# EAGLE schematic spicboard-v3 (EAGLE 8.1.1)
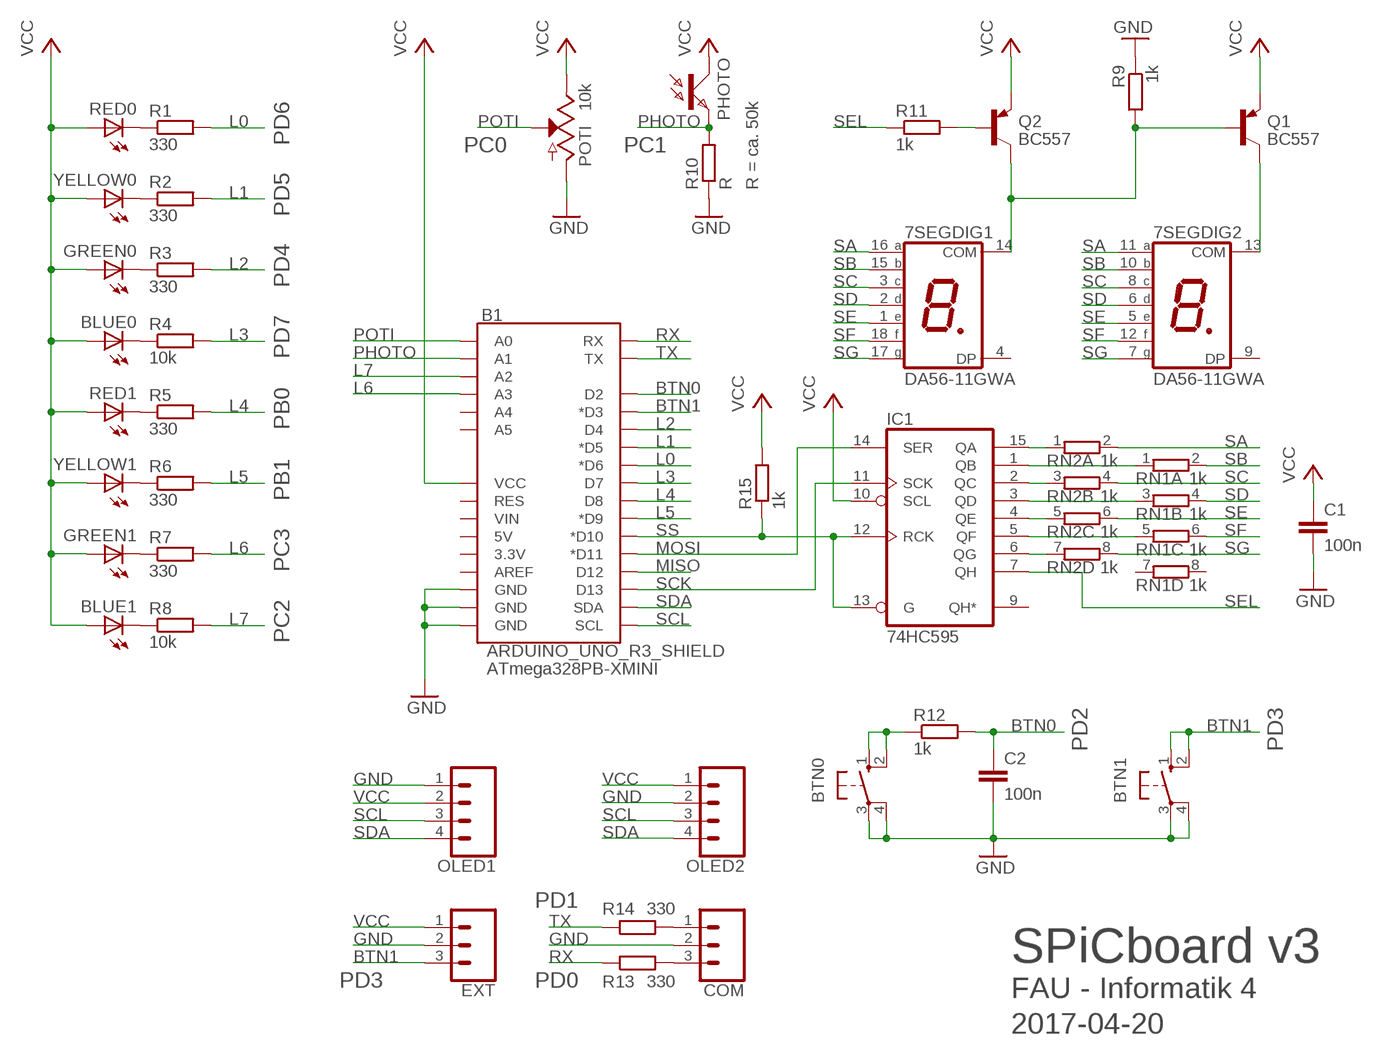
[diagram p0: schematic, sheet 1]

## Parts
7SEG  DA56-11GWA  [DA56]
B1  ARDUINO_UNO_R3_SHIELD  [UNO_R3_SHIELD_FINAL]
BLUE0  LED5MM  [LED5MM]
BLUE1  LED5MM  [LED5MM]
BTN0  10-XX  [B3F-10XX]
BTN1  10-XX  [B3F-10XX]
C1  100n  C2.5/2  [C2.5-2]
C2  100n  C2.5/2  [C2.5-2]
COM  CONN_03  [1X03]
EXT  CONN_03  [1X03]
GREEN0  LED5MM  [LED5MM]
GREEN1  LED5MM  [LED5MM]
IC1  74HC595  74HC595N  [DIL16]
OLED1  CONN_04  [1X04]
OLED2  CONN_04  [1X04]
PHOTO  PTPT  [PT]
POTI  10k  POTENTIOMETER-PTH-9MM-1/20W-20%  [POT-PTH-ALPS]
Q1  BC557  [TO92-EBC]
Q2  BC557  [TO92-EBC]
R1  330  R-EU_0207/10  [0207/10]
R2  330  R-EU_0207/10  [0207/10]
R3  330  R-EU_0207/10  [0207/10]
R4  10k  R-EU_0207/10  [0207/10]
R5  330  R-EU_0207/10  [0207/10]
R6  330  R-EU_0207/10  [0207/10]
R7  330  R-EU_0207/10  [0207/10]
R8  10k  R-EU_0207/10  [0207/10]
R9  1k  R-EU_0207/10  [0207/10]
R10  R  R-EU_0207/10  [0207/10]
R11  1k  R-EU_0207/10  [0207/10]
R12  1k  R-EU_0207/10  [0207/10]
R13  330  R-EU_0207/10  [0207/10]
R14  330  R-EU_0207/10  [0207/10]
R15  1k  R-EU_0207/10  [0207/10]
RED0  LED5MM  [LED5MM]
RED1  LED5MM  [LED5MM]
RN1  1k  E4R  [SIL8]
RN2  1k  E4R  [SIL8]
YELLOW0  LED5MM  [LED5MM]
YELLOW1  LED5MM  [LED5MM]

## Nets
BTN0: B1.D2 C2.1 R12.2
BTN1: B1.D3(*D3) BTN1.1(S) BTN1.2(S1) EXT.3
GND: B1.GND@0(GND) B1.GND@1(GND) B1.GND@2(GND) BTN0.3(P) BTN0.4(P1) BTN1.3(P) BTN1.4(P1) C1.2 C2.2 COM.2 EXT.2 OLED1.1 OLED2.2 POTI.P$3(A) R9.1 R10.1
L0: B1.D6(*D6) R1.2
L1: B1.D5(*D5) R2.2
L2: B1.D4 R3.2
L3: B1.D7 R4.2
L4: B1.D8 R5.2
L5: B1.D9(*D9) R6.2
L6: B1.A3 R7.2
L7: B1.A2 R8.2
MISO: B1.D12
MOSI: B1.D11(*D11) IC1.14(SER)
N$1: IC1.15(QA) RN2.1
N$2: R1.1 RED0.K(C)
N$3: R2.1 YELLOW0.K(C)
N$4: GREEN0.K(C) R3.1
N$5: BLUE0.K(C) R4.1
N$6: R5.1 RED1.K(C)
N$7: R6.1 YELLOW1.K(C)
N$8: GREEN1.K(C) R7.1
N$9: BLUE1.K(C) R8.1
N$10: IC1.2(QC) RN2.3
N$11: IC1.4(QE) RN2.5
N$12: IC1.6(QG) RN2.7
N$13: IC1.3(QD) RN1.3
N$14: IC1.1(QB) RN1.1
N$15: COM.1 R14.2
N$16: IC1.5(QF) RN1.5
N$17: 7SEG.13(DIG2:COM) Q1.C
N$18: 7SEG.14(DIG1:COM) Q1.B Q2.C R9.2
N$19: BTN0.1(S) BTN0.2(S1) R12.1
N$20: Q2.B R11.2
N$21: COM.3 R13.2
PHOTO: B1.A1 PHOTO.E R10.2
POTI: B1.A0 POTI.P$2(S)
RX: B1.RX R13.1
SA: 7SEG.11(DIG2:A) 7SEG.16(DIG1:A) RN2.2
SB: 7SEG.10(DIG2:B) 7SEG.15(DIG1:B) RN1.2
SC: 7SEG.3(DIG1:C) 7SEG.8(DIG2:C) RN2.4
SCK: B1.D13 IC1.11(SCK)
SCL: B1.SCL OLED1.3 OLED2.3
SD: 7SEG.2(DIG1:D) 7SEG.6(DIG2:D) RN1.4
SDA: B1.SDA OLED1.4 OLED2.4
SE: 7SEG.1(DIG1:E) 7SEG.5(DIG2:E) RN2.6
SEL: IC1.7(QH) R11.1
SF: 7SEG.12(DIG2:F) 7SEG.18(DIG1:F) RN1.6
SG: 7SEG.7(DIG2:G) 7SEG.17(DIG1:G) RN2.8
SS: B1.D10(*D10) IC1.12(RCK) IC1.13(G) R15.1
TX: B1.TX R14.1
VCC: B1.VCC BLUE0.A BLUE1.A C1.1 EXT.1 GREEN0.A GREEN1.A IC1.10(SCL) OLED1.2 OLED2.1 PHOTO.C POTI.P$1(E) Q1.E Q2.E R15.2 RED0.A RED1.A YELLOW0.A YELLOW1.A
Unconnected: 7SEG.4(DIG1:DP) 7SEG.9(DIG2:DP) B1.3.3V B1.5V B1.A4 B1.A5 B1.AREF B1.RES B1.VIN IC1.9(QH*) RN1.7 RN1.8

## Notes on the sheet
- PD6
- PC0 | PC1
- R = ca. 50k
- PD5
- PD4
- PD7
- PB0
- PB1
- PC3
- PC2
- ATmega328PB-XMINI
- PD2 | PD3
- PD1
- SPiCboard v3
- PD3 | PD0
- FAU - Informatik 4
- 2017-04-20

## Power pins joined to a net without a drawn wire
GND: IC1.8(GND)
VCC: IC1.16(VCC)

## Library data of the parts
7SEG = spicboard-v3:DA56-11: 14.22mm (0.56INCH) DUAL DIGIT NUMERIC DISPLAYS Source: www.kingbright.com .. DA56-11SRWA.pdf; OC_FARNELL: unknown; OC_NEWARK: unknown
B1 = spicboard-v3:ARDUINO_UNO_R3_SHIELD: Arduino R3 Shield Footprint Shield form compatible with the Arduino Uno R3. SparkFun Products: MG2639 Cellular Shield <https://www.sparkfun.com/products/13120> MIDI Shield <https://www.sparkfun.com/products/12898> R3 Stackable Headers Kit <https://www.sparkfun.com/products/11417>
BLUE0 BLUE1 GREEN0 GREEN1 RED0 RED1 YELLOW0 YELLOW1 = spicboard-v3:LED: LED OSRAM: - CHIPLED LG R971, LG N971, LY N971, LG Q971, LY Q971, LO R971, LY R971 LH N974, LH R974 LS Q976, LO Q976, LY Q976 LO Q996 - Hyper CHIPLED LW Q18S LB Q993, LB Q99A, LB R99A - SideLED LS A670, LO A670, LY A670, LG A670, LP A670 LB A673, LV A673, LT A673, LW A673 LH A674 LY A675 LS A676, LA A676, LO A676, LY A676, LW A676 LS A679, LY A679, LG A679 - Hyper Micro SIDELED® LS Y876, LA Y876, LO Y876, LY Y876 LT Y87S - SmartLED LW L88C, LW L88S LB L89C, LB L89S, LG L890 LS L89K, LO L89K, LY L89K LS L896, LA L896, LO L896, LY L896 - TOPLED LS T670, LO T670, LY T670, LG T670, LP T670 LSG T670, LSP T670, LSY T670, LOP T670, LYG T670 LG T671, LOG T671, LSG T671 LB T673, LV T673, LT T673, LW T673 LH T674 LS T676, LA T676, LO T676, LY T676, LB T676, LH T676, LSB T676, LW T676 LB T67C, LV T67C, LT T67C, LS T67K, LO T67K, LY T67K, LW E67C LS E67B, LA E67B, LO E67B, LY E67B, LB E67C, LV E67C, LT E67C LW T67C LS T679, LY T679, LG T679 LS T770, LO T770, LY T770, LG T770, LP T770 LB T773, LV T773, LT T773, LW T773 LH T774 LS E675, LA E675, LY E675, LS T675 LS T776, LA T776, LO T776, LY T776, LB T776 LHGB T686 LT T68C, LB T68C - Hyper Mini TOPLED® LB M676 - Mini TOPLED Santana® LG M470 LS M47K, LO M47K, LY M47K Source: http://www.osram.convergy.de LUXEON: - LUMILED® LXK2-PW12-R00, LXK2-PW12-S00, LXK2-PW14-U00, LXK2-PW14-V00 LXK2-PM12-R00, LXK2-PM12-S00, LXK2-PM14-U00 LXK2-PE12-Q00, LXK2-PE12-R00, LXK2-PE12-S00, LXK2-PE14-T00, LXK2-PE14-U00 LXK2-PB12-K00, LXK2-PB12-L00, LXK2-PB12-M00, LXK2-PB14-N00, LXK2-PB14-P00, LXK2-PB14-Q00 LXK2-PR12-L00, LXK2-PR12-M00, LXK2-PR14-Q00, LXK2-PR14-R00 LXK2-PD12-Q00, LXK2-PD12-R00, LXK2-PD12-S00 LXK2-PH12-R00, LXK2-PH12-S00 LXK2-PL12-P00, LXK2-PL12-Q00, LXK2-PL12-R00 Source: www.luxeon.com KINGBRIGHT: KA-3528ASYC Source: www.kingbright.com
BTN0 BTN1 = switch-omron:10-XX: OMRON SWITCH; MPN: B3F-1000; OC_FARNELL: 176432; OC_NEWARK: 36M3542
C1 C2 = spicboard-v3:C: CAPACITOR naming: grid - package width
COM EXT = SparkFun-Connectors:CONN_03: Multi connection point. Often used as Generic Header-pin footprint for 0.1 inch spaced/style header connections On any of the 0.1 inch spaced packages, you can populate with these: Break Away Headers - Straight <https://www.sparkfun.com/products/116> (PRT-00116) Break Away Male Headers - Right Angle <https://www.sparkfun.com/products/553> (PRT-00553) Female Headers <https://www.sparkfun.com/products/115> (PRT-00115) Break Away Headers - Machine Pin <https://www.sparkfun.com/products/117> (PRT-00117) Break Away Female Headers - Swiss Machine Pin <https://www.sparkfun.com/products/743> (PRT-00743) Stackable Header - 3 Pin (Female, 0.1") <https://www.sparkfun.com/products/13875> (PRT-13875) For SCREWTERMINALS and SPRING TERMINALS visit here: Screw Terimnals on SparkFun.com <https://www.sparkfun.com/search/results?term=Screw+Terminals> (5mm/3.5mm/2.54mm spacing) This device is also useful as a general connection point to wire up your design to another part of your project. Our various solder wires solder well into these plated through hole pads. Hook-Up Wire - Assortment (Stranded, 22 AWG) <https://www.sparkfun.com/products/11375> (PRT-11375) Hook-Up Wire - Assortment (Solid Core, 22 AWG) <https://www.sparkfun.com/products/11367> (PRT-11367) View the entire wire category on our website here <https://www.sparkfun.com/categories/141> Special notes: Molex polarized connector foot print use with SKU : PRT-08232 with associated crimp pins and housings.
IC1 = 74xx-eu:74*595: 8-bit SHIFT REGISTER, output latch
OLED1 OLED2 = SparkFun-Connectors:CONN_04: Multi connection point. Often used as Generic Header-pin footprint for 0.1 inch spaced/style header connections On any of the 0.1 inch spaced packages, you can populate with these: Break Away Headers - Straight <https://www.sparkfun.com/products/116> (PRT-00116) Break Away Male Headers - Right Angle <https://www.sparkfun.com/products/553> (PRT-00553) Female Headers <https://www.sparkfun.com/products/115> (PRT-00115) Break Away Headers - Machine Pin <https://www.sparkfun.com/products/117> (PRT-00117) Break Away Female Headers - Swiss Machine Pin <https://www.sparkfun.com/products/743> (PRT-00743) For SCREWTERMINALS and SPRING TERMINALS visit here: Screw Terimnals on SparkFun.com <https://www.sparkfun.com/search/results?term=Screw+Terminals> (5mm/3.5mm/2.54mm spacing) This device is also useful as a general connection point to wire up your design to another part of your project. Our various solder wires solder well into these plated through hole pads. Hook-Up Wire - Assortment (Stranded, 22 AWG) <https://www.sparkfun.com/products/11375> (PRT-11375) Hook-Up Wire - Assortment (Solid Core, 22 AWG) <https://www.sparkfun.com/products/11367> (PRT-11367) View the entire wire category on our website here <https://www.sparkfun.com/categories/141> Special notes: Molex polarized connector foot print use with SKU : PRT-08231 with associated crimp pins and housings. 1MM SMD Version SKU: PRT-10208; PROD_ID: CONN-09696
PHOTO = spicboard-v3:PT
POTI = spicboard-v3:POTENTIOMETER: Potentiometer (Pot) Three-terminal potentiometers, with an adjustable wiper and two adjustable resistors. A pot can be used to create a configurable voltage divider, or as a variable resistor. Variants ALPS_POT and ALPS_POT_KIT - PTH, breadboard compatible, 9mm square pots Rotary Potentiometer - Linear (10k ohm) <https://www.sparkfun.com/products/9288> (COM-09288) The KIT variant exposes copper on only one side of the PTH pad, so the part can only be assembled on one side of the PCB. Useful for beginner soldering kits.; PROD_ID: RES-09177; SF_SKU: COM-09288
Q1 Q2 = transistor-pnp:BC557*: PNP Transistror
R1-R15 = spicboard-v3:R-EU_: RESISTOR, European symbol
RN1 RN2 = spicboard-v3:E4R: SIL RESISTOR; OC_FARNELL: unknown; OC_NEWARK: unknown